# Altium project arbinataU1.PrjPcb
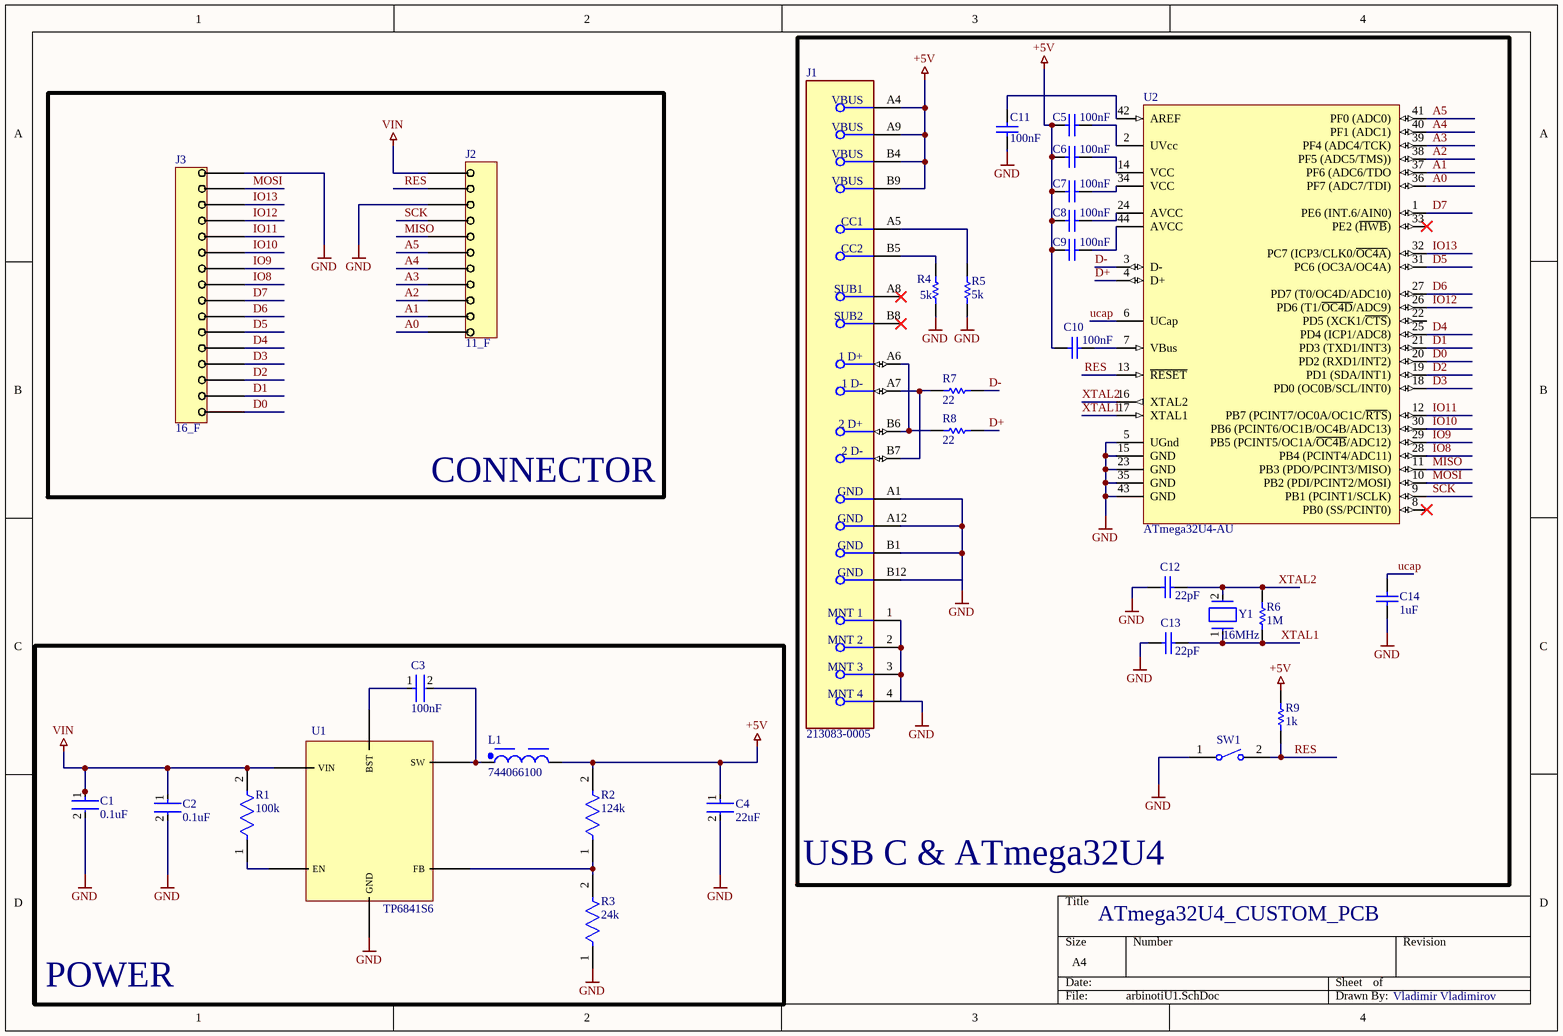
[diagram p0: arbinotiU1.SchDoc]
1 sheet, 31 parts. Net scope: global (net labels, ports and power ports of the same name join across sheets).
Board file: arbinotiU1.PcbDoc

## Sheet arbinotiU1.SchDoc
size A4; SheetNumber: 1; SheetTotal: 1

### Parts
C1  0.1uF  [FP-CL32-IPC_C]
C2  0.1uF  [FP-CL32-IPC_C]
C3  100nF  [FP-GCD21B-0_15-MFG]
C4  22uF  [FP-CL32-IPC_C]
C5  100nF  [CAPC2013X140X50NL20T25]
C6  100nF  [CAPC2013X140X50NL20T25]
C7  100nF  [CAPC2013X140X50NL20T25]
C8  100nF  [CAPC2013X140X50NL20T25]
C9  100nF  [CAPC2013X140X50NL20T25]
C10  100nF  [CAPC2013X140X50NL20T25]
C11  100nF  [CAPC2013X140X50NL20T25]
C12  22pF  [CAPC2013X94X50NL20T25]
C13  22pF  [CAPC2013X94X50NL20T25]
C14  1uF  [CAPC2013X140X50ML20T25]
J1  213083-0005  [FP-2130830005-MFG]
J2  11_F  [header_11]
J3  16_F  [haeder_16]
L1  744066100  [WE-TPC_1038]
R1  100k  [FP-RC0805-0_6-MFG]
R2  124k  [FP-RT0805-MFG]
R3  24k  [FP-CRCW0805-HPe3-MFG]
R4  5k  [RESC2013X50X30ML20T20]
R5  5k  [RESC2013X50X30ML20T20]
R6  1M  [RESC2013X60X35ML10T20]
R7  22  [RESC2013X70X40NL20T20]
R8  22  [RESC2013X70X40NL20T20]
R9  1k  [RESC2013X60X30NL20T20]
SW1  FSMSM  [TECO-FSMSM-2_V]  (value not drawn)
U1  TP6841S6  [SOT23127P600-8N]
U2  ATmega32U4-AU  [44ML_N]
Y1  16MHz  [FP-ABM7-MFG]

### Blocks framed on the sheet
USB C & ATmega32U4: C5-C14 J1 R4-R9 SW1 U2 Y1
CONNECTOR: J2 J3
POWER: C1-C4 L1 R1-R3 U1

### Nets
+5V: C4.1 C5.1 C6.1 C7.1 C8.1 C9.1 C10.1 J1.A4(VBUS) J1.A9(VBUS) J1.B4(VBUS) J1.B9(VBUS) L1.2 R2.2 R9.2
GND: C1.2 C2.2 C4.2 C11.1 C12.1 C13.1 C14.2 J1.1(MNT_1) J1.2(MNT_2) J1.3(MNT_3) J1.4(MNT_4) J1.A1(GND) J1.A12(GND) J1.B1(GND) J1.B12(GND) J2.15(PC6) J3.24(PC6) R3.1 R4.2 R5.2 SW1.1 U1.2(GND) U2.5(UGnd) U2.15(GND) U2.23(GND) U2.35(GND) U2.43(GND)
VIN: C1.1 C2.1 J2.17(PC6) R1.2 U1.5(VIN)
A0: J2.7(PC6) U2.36(PF7_(ADC7/TDI))
A1: J2.8(PC6) U2.37(PF6_(ADC6/TDO)
A2: J2.9(PC6) U2.38(PF5_(ADC5/TMS)))
A3: J2.10(PC6) U2.39(PF4_(ADC4/TCK))
A4: J2.11 U2.40(PF1_(ADC1))
A5: J2.12(PC6) U2.41(PF0_(ADC0))
D0: J3.39(PC6) U2.20(PD2_(RXD1/INT2))
D1: J3.38(PC6) U2.21(PD3_(TXD1/INT3))
D2: J3.37(PC6) U2.19(PD1_(SDA/INT1))
D3: J3.36(PC6) U2.18(PD0_(OC0B/SCL/INT0))
D4: J3.35(PC6) U2.25(PD4_(ICP1/ADC8))
D5: J3.34 U2.31(PC6_(OC3A/OC4A))
D6: J3.33(PC6) U2.27(PD7_(T0/OC4D/ADC10))
D7: J3.32 U2.1(PE6_(INT.6/AIN0))
D+: R8.2 U2.4(D+)
D-: R7.2 U2.3(D-)
IO8: J3.31(PC6) U2.28(PB4_(PCINT4/ADC11))
IO9: J3.30(PC6) U2.29(PB5_(PCINT5/OC1A/~{OC4B}/ADC12))
IO10: J3.29(PC6) U2.30(PB6_(PCINT6/OC1B/OC4B/ADC13))
IO11: J3.28(PC6) U2.12(PB7_(PCINT7/OC0A/OC1C/~{RTS}))
IO12: J3.27(PC6) U2.26(PD6_(T1/~{OC4D}/ADC9))
IO13: J3.26(PC6) U2.32(PC7_(ICP3/CLK0/~{OC4A}))
MISO: J2.13 U2.11(PB3_(PDO/PCINT3/MISO))
MOSI: J3.25(PC6) U2.10(PB2_(PDI/PCINT2/MOSI))
RES: J2.16(PC6) R9.1 SW1.2 U2.13(~{RESET})
SCK: J2.14(PC6) U2.9(PB1_(PCINT1/SCLK))
ucap: C14.1 U2.6(UCap)
XTAL1: C13.2 R6.1 U2.17(XTAL1) Y1.1
XTAL2: C12.2 R6.2 U2.16(XTAL2) Y1.2
NetC3_1: C3.1 U1.1(BST)
NetC3_2: C3.2 L1.1 U1.6(SW)
NetC5_2: C5.2 U2.2(UVcc)
NetC6_2: C6.2 U2.14(VCC)
NetC7_2: C7.2 U2.34(VCC)
NetC8_2: C8.2 U2.24(AVCC)
NetC9_2: C9.2 U2.44(AVCC)
NetC10_2: C10.2 U2.7(VBus)
NetC11_2: C11.2 U2.42(AREF)
NetJ1_A5: J1.A5(CC1) R5.1
NetJ1_A6: J1.A6(1_D+) J1.B6(2_D+) R8.1
NetJ1_A7: J1.A7(1_D-) J1.B7(2_D-) R7.1
NetJ1_B5: J1.B5(CC2) R4.1
NetR1_1: R1.1 U1.4(EN)
NetR2_1: R2.1 R3.2 U1.3(FB)

Not connected (* = marked no-connect by the designer): J1 A8(SUB1)* B8(SUB2)*; U2 8(PB0_(SS/PCINT0))* 22(PD5_(XCK1/~{CTS})) 33(PE2_(~{HWB}))*

### Notes on the sheet
- ATmega32U4_CUSTOM_PCB
- Vladimir Vladimirov

### Library data of the parts
C1 C2 C4 = CMP-13271-003500-1: Cap Ceramic 22uF 16V X7R ±10% SMD 1210 +125°C Embossed T/R; Voltage: 10V; Lead Free: Lead Free; Max Operating Temperature: 125°C; Width: 0.098inch; Min Operating Temperature: -55°C; Height: 2.5mm; Tolerance: 10%; Voltage Rating (DC): 16V; Radiation Hardening: No; Case Code (Imperial): 1210; Thickness: 0.106inch; Material: Ceramic; Package Quantity: 1; Length: 3.2mm; Depth: 2.5mm; Case/Package: 1210; Voltage Rating: 16V; Mount: Surface Mount; Case Code (Metric): 3225; Packaging: Tape and Reel; Dielectric: X7R
  C1 C2: Capacitance: 0.1uF
  C4: Capacitance: 22uF
C3 = CMP-06035-045527-1: Chip Multilayer Ceramic Capacitors for Automotive, 0805, 0.10uF, X7R, 15%, 10%, 50V, Grade 1; Case Code (Metric): 2012; Voltage Rating: 50V; Height: 1.25mm; Weight: 0.000335oz; Mount: Surface Mount; Width: 0.049inch; Packaging: Tape and Reel; Min Operating Temperature: -55°C; Depth: 1.25mm; Length: 2mm; Max Operating Temperature: 125°C; Ratings: AEC-Q200; Termination: SMD/SMT; Capacitance: 100nF; Thickness: 0.049inch; Case/Package: 0805; Voltage Rating (DC): 50V; Dielectric: X7R; Case Code (Imperial): 0805; Tolerance: 10%; Package Quantity: 3000
C5-C11 = CMP-2007-04784-1: Manufacturer: AVX Interconnect / Elco; Part Number: 08055F104KAT2A
C12 C13 = CMP-2007-04137-1: Manufacturer: AVX Interconnect / Elco; Part Number: 08051A220KAT2A
C14 = CMP-1036-04744-2: Part Number: 0805YC105JAT2A; Manufacturer: AVX Interconnect / Elco
J1 = CMP-04767-000030-2: CONN RCP USB2.0 TYP C 24P SMD RA; NexarPartId: 114105384; Current Rating: 5A; Number of Contacts: 16; Voltage Rating: 30V; Gender: Receptacle; Min Operating Temperature: -40°C; USB Standard: USB 2.0; Max Operating Temperature: 85°C; Contact Material: Gold, Nickel; Schedule B: 8536695050, 8536695050; Country of Origin: CN
J2 = header_11
J3 = header_16
L1 = CMP-0227-00093-3: NexarPartId: 22803276; Tolerance: 30%; Current Rating: 3.6A; Saturation Current: 4A; Shielding: Shielded; Resistance: 28mΩ; DC Resistance (DCR): 25mΩ; Series Resistance: 35mΩ; Inductance: 10µH; Core Material: Ferrite; Test Frequency: 100kHz; Self Resonant Frequency: 20MHz; Ambient Temperature Range Low: -40°C; RoHS: Compliant; Case/Package: Nonstandard; Number of Pins: 2; Width: 10mm; Max Operating Temperature: 125°C; Ambient Temperature Range High: 95°C; Length: 10mm; Min Operating Temperature: -40°C; REACH SVHC: Unknown; Termination: SMD/SMT; Height: 3.8mm; Max DC Current: 3.6A; Mount: Surface Mount; Weight: 1.273007g; Composition: Wirewound; RMS Current (Irms): 3.6A; Inductance Tolerance: 30%; Height - Seated (Max): 4.0894mm; Packaging: Cut Tape (CT); Depth: 10mm
R1 = CMP-03412-037835-1: RES SMD 100K OHM 5% 1/8W 0805; Voltage Rating: 150V; Power Rating: 125mW; Temperature Coefficient: 100ppm/°C; Resistance: 100kR; Radiation Hardening: No; Lead Free: Lead Free; Size Code: 0805; Resistance Tolerance: 5%; Case Code (Imperial): 0805; Min Operating Temperature: -55°C; Packaging: Tape and Reel; Termination: SMD/SMT; Number of Terminations: 2; RoHS Compliant: Yes; Features: Moisture Resistant; Construction: Rectangular; Series: RC; Max Operating Temperature: 155°C; Military Standard: Not; Depth: 1.25mm; Contact Plating: Tin; Tolerance: 5%; Max Power Dissipation: 125mW; Length: 2mm; Case Code (Metric): 2012; Resistor Type: Thick Film; Case/Package: 0805
R2 = CMP-2001-01506-2: RES 124K OHM 1/8W .1% SMD 0805; Manufacturer Part Number: RT0805BRD07124KL; Manufacturer: Yageo; Voltage Rating: 150V; Resistance: 124KΩ; Temperature Coefficient: 25 ppm/°C; Power Rating: 0.125W; Tolerance: 0.0025; Value: 124KΩ; Device Class L3: Chip SMD Resistors; ComponentLink2Description: Datasheet; Footprint Url: http://www.yageo.com/exep/pages/download/literatures/PYu-R_Mount_10.pdf; RoHS: TRUE; Ipc Land Pattern Name: RESC200125X50; Lead Free: Yes; Mouser Description: Thin Film Resistors - SMD 1/8W 124K ohm .1% 25ppm; Series: RT; Package: RT0805; ComponentLink2URL: http://www.yageo.com/documents/recent/PYu-RT_1-to-0.01_RoHS_L_9.pdf; Device Class L1: Passive Components; Octopart: https://octopart.com/rt0805brd07124kl-yageo-1365830; Device Class L2: Resistors; Category: Res; Temperature Range Low: -55°C; Digikey Description: RES 124K OHM 1/8W .1% SMD 0805; Automotive: No; Temperature: -55°C to +155°C; Composition: Thin Film; Temperature Range High: +155°C; Height: 0.6mm
R3 = CMP-02407-002305-1: RES Thick Film, 24kΩ, 1%, 0.5W, 100ppm/°C, 0805; Power Rating: 330mW; Max Power Dissipation: 333mW; Resistance: 24kR; Contact Plating: Tin; Mount: Surface Mount; Temperature Coefficient: 100ppm/°C; Width: 0.049inch; Packaging: Tape and Reel; Number of Terminations: 2; Height: 0.024inch; Tolerance: 1%; Length: 0.079inch; Termination: Wraparound; Case/Package: 0805; Min Operating Temperature: -55°C; Package Quantity: 5000; Composition: Thick Film; Features: Automotive AEC-Q200; Lead Free: Lead Free; Max Operating Temperature: 155°C
R4 R5 = CMP-2001-04234-1: Part Number: CRCW08054K99FKTA; Manufacturer: Vishay Dale
R6 = CMP-2001-01491-1: Manufacturer: Yageo; Part Number: RT0805BRE071ML
R7 R8 = CMP-2001-00523-1: Part Number: ERJ6ENF22R0V; Manufacturer: Panasonic
R9 = CMP-2001-04656-1: Part Number: RK73B2ATTD102J; Manufacturer: KOA Speer
SW1 = CMP-2000-07511-1: FSMSM Push Button Switch, 50 mA, -35 to 85 degC, 2-Pin SMD, RoHS, Bulk; Manufacturer: TE Connectivity; Actuator Length: 1.07mm; Electrical Life: 20000Cycles; Actuator Material: Polyamide; Current Rating: 50mA; Illumination Type: Illuminated; Voltage Rating (DC): 24V; Contact Resistance: 100mOhm; Case\/Package: SMD/SMT; Operating Force: 180gf; Switch Travel: 0.25mm; Max Voltage Rating (DC): 12V; Throw Configuration: SPST; Packaging: LoosePiece; Max Operating Temperature: 85degC; ELV: Compliant; Package Description: 2-Pin Surface Mount Device, Body 6 x 3.5 mm, Pitch 9.19 mm; RoHSCompliant: true; Manufacturer URL: http://www.te.com/; Contact Plating: Silver; Contact Material: Brass; Mounting Technology: SurfaceMount; Contact Current Rating: 50mA; Datasheet Version: Rev. C2, 08/2014; Datasheet URL: http://www.te.com/commerce/DocumentDelivery/DDEController?Action=showdoc&DocId=Customer+Drawing%7F1437566-3%7FC2%7Fpdf%7FEnglish%7FENG_CD_1437566-3_C2_1437566_3_1_c.dwg.pdf%7F1437566-3; Mechanical Life: 20000Cycles; Package Reference: FSMSM; REACH SVHC: Unknown; Orientation: Straight; Min Operating Temperature: -35degC; Lead Free: LeadFree; Termination: GullWing; Package Quantity: 1000; Mount: SurfaceMount
U2 = CMP-0095-00285-2: 8-bit AVR Microcontroller, 2.7-5.5V, 16MHz, 32KB Flash, 1KB EEPROM, 2.5KB SRAM, USB Controller, 44-pin TQFP, Industrial Grade (-40°C to 85°C), Ext Osc; RevisionNote: DatasheetVersion updated. URLs added.; ComponentLink1Description: Manufacturer URL; PackageDescription: 44-Pin Plastic Thin Quad Flat Pack, 10 x 10 x 1.0 mm Body, 0.8 mm Pitch (TQFP); DatasheetVersion: revF, Nov-2010; ComponentLink2URL: http://www.atmel.com/dyn/resources/prod_documents/doc7766.pdf; ComponentLink1URL: http://www.atmel.com/; PackageReference: 44ML; ComponentLink2Description: ATmega16U4/32U4 Datasheet; PackageVersion: rev.G, Jul-2007; ComponentLink3URL: http://www.atmel.com/dyn/resources/prod_documents/7766S.pdf; ComponentLink3Description: ATmega16U4 ATmega32U4 Summary
Y1 = CMP-27762-000095-1: Crystal 16MHz ±20ppm 18pF SMD-2 6mm x 3.5mm; ESR (Equivalent Series Resistance): 50R; Frequency Stability: 30ppm; Width: 3.3mm; Frequency: 16MHz; Radiation Hardening: No; Height: 0.055inch; Tolerance: 20ppm; Length: 6mm; Case/Package: CSMD; Lead Free: Lead Free; Min Operating Temperature: -40°C; Termination: SMD/SMT; Operating Frequency: 16 MHz; Resistor Type: Ceramic; Packaging: Tape and Reel; Mount: Surface Mount; Load Capacitance: 18pF; Frequency Tolerance: 20ppm; Depth: 3.5mm; Series: ABM7; Package Quantity: 1000; Max Operating Temperature: 85°C; Number of Pins: 2